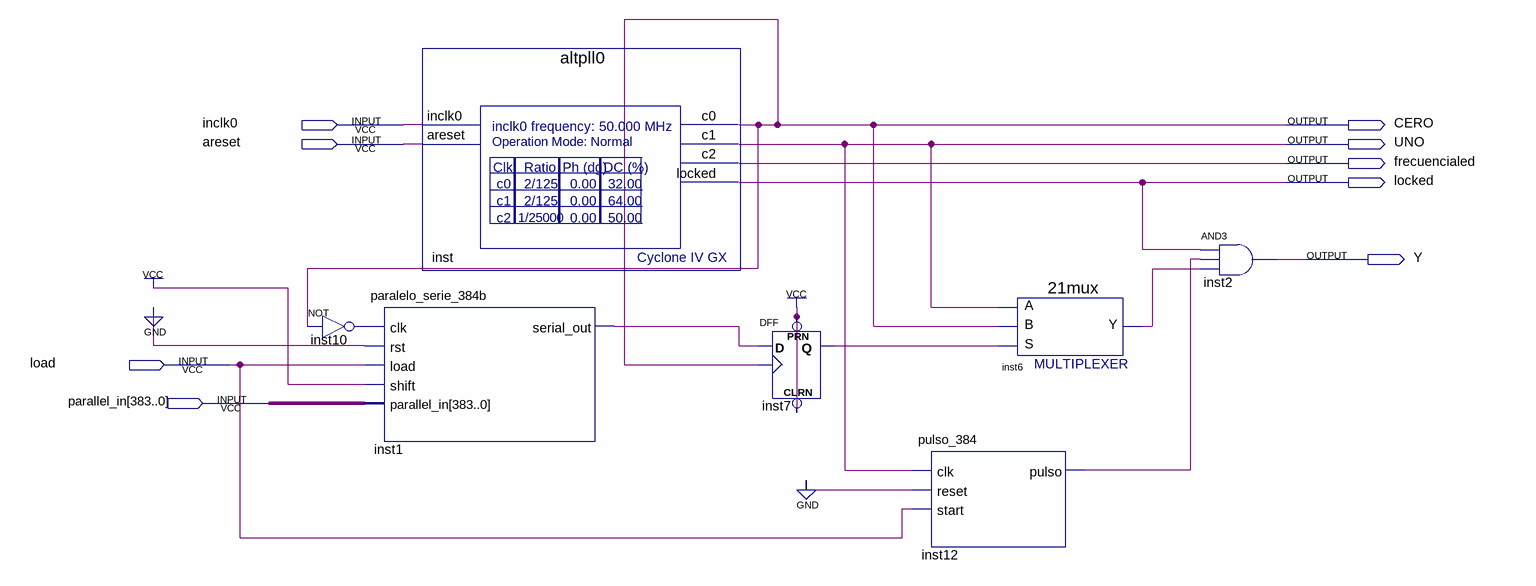
[diagram p0: schematic sheet]
// Quartus schematic Block1.bdf as structural Verilog: 7 symbols, 9 pins
module Block1 (
  input  inclk0,
  input  areset,
  input  load,
  input  [383:0] parallel_in,
  output CERO,
  output UNO,
  output frecuencialed,
  output locked,
  output Y
);

  wire inst1_serial_out, inst6_y, inst7_q, inst10_out, inst12_pulso;

  not inst10 (inst10_out, CERO);
  paralelo_serie_384b inst1 (
    .clk(inst10_out), .rst(1'b0), .load(load), .shift(1'b1), .parallel_in(parallel_in),
    .serial_out(inst1_serial_out));
  altpll0 inst (.inclk0(inclk0), .areset(areset), .c0(CERO), .c1(UNO), .c2(frecuencialed), .locked(locked));
  DFF inst7 (.CLRN(1'b1), .CLK(CERO), .D(inst1_serial_out), .PRN(1'b1), .Q(inst7_q));
  pulso_384 inst12 (.clk(UNO), .reset(1'b0), .start(load), .pulso(inst12_pulso));
  \21mux  inst6 (.S(inst7_q), .B(CERO), .A(UNO), .Y(inst6_y));
  and inst2 (Y, locked, inst12_pulso, inst6_y);
endmodule
